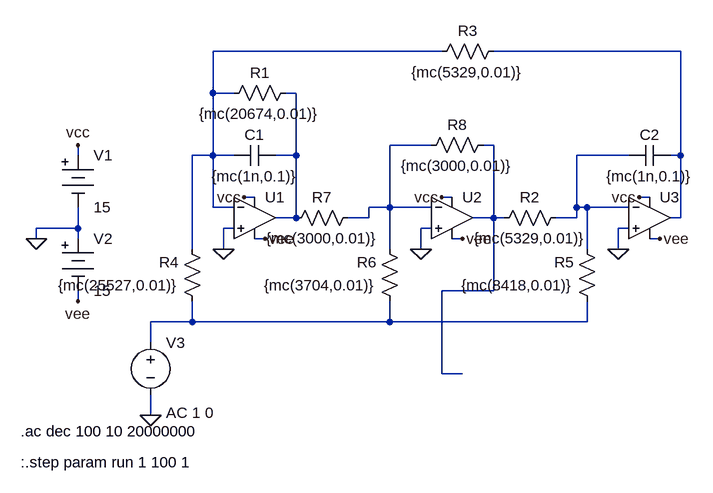
[diagram p0: schematic FlescherTow.asc]
FlescherTow.asc, the LTspice schematic file:
Version 4
SHEET 1 880 680
WIRE 352 -96 0 -96
WIRE 720 -96 432 -96
WIRE 0 -32 0 -96
WIRE 32 -32 0 -32
WIRE 128 -32 112 -32
WIRE 336 48 272 48
WIRE 432 48 416 48
WIRE -208 64 -208 48
WIRE 0 64 0 -32
WIRE 0 64 -32 64
WIRE 32 64 0 64
WIRE 128 64 128 -32
WIRE 128 64 96 64
WIRE 640 64 560 64
WIRE 720 64 720 -96
WIRE 720 64 704 64
WIRE 64 128 48 128
WIRE 368 128 352 128
WIRE 672 128 656 128
WIRE 0 144 0 64
WIRE 32 144 0 144
WIRE 272 144 272 48
WIRE 272 144 240 144
WIRE 336 144 272 144
WIRE 560 144 560 64
WIRE 576 144 560 144
WIRE 640 144 576 144
WIRE 128 160 128 64
WIRE 128 160 96 160
WIRE 240 160 240 144
WIRE 240 160 208 160
WIRE 432 160 432 48
WIRE 432 160 400 160
WIRE 448 160 432 160
WIRE 560 160 560 144
WIRE 560 160 528 160
WIRE 720 160 720 64
WIRE 720 160 704 160
WIRE -208 176 -208 144
WIRE -208 176 -272 176
WIRE 32 176 16 176
WIRE 336 176 320 176
WIRE 640 176 624 176
WIRE -272 192 -272 176
WIRE -208 192 -208 176
WIRE 80 192 64 192
WIRE 384 192 368 192
WIRE 688 192 672 192
WIRE -32 208 -32 64
WIRE 16 208 16 176
WIRE 272 208 272 144
WIRE 320 208 320 176
WIRE 576 208 576 144
WIRE 624 208 624 176
WIRE 432 272 432 160
WIRE 432 272 352 272
WIRE -208 288 -208 272
WIRE -32 320 -32 288
WIRE -32 320 -96 320
WIRE 272 320 272 288
WIRE 272 320 -32 320
WIRE 576 320 576 288
WIRE 576 320 272 320
WIRE -96 352 -96 320
WIRE 352 400 352 272
WIRE 384 400 352 400
WIRE -96 464 -96 432
FLAG -272 192 0
FLAG -208 48 vcc
FLAG 48 128 vcc
FLAG 352 128 vcc
FLAG 656 128 vcc
FLAG -208 288 vee
FLAG 80 192 vee
FLAG 384 192 vee
FLAG 688 192 vee
FLAG 624 208 0
FLAG 320 208 0
FLAG 16 208 0
FLAG -96 464 0
SYMBOL Opamps\\UniversalOpamp2 64 160 R0
SYMATTR InstName U1
SYMBOL Opamps\\UniversalOpamp2 368 160 R0
SYMATTR InstName U2
SYMBOL Opamps\\UniversalOpamp2 672 160 R0
SYMATTR InstName U3
SYMBOL res 128 -48 R90
WINDOW 0 0 56 VBottom 2
WINDOW 3 32 56 VTop 2
SYMATTR InstName R1
SYMATTR Value {mc(20674,0.01)}
SYMBOL res 544 144 R90
WINDOW 0 0 56 VBottom 2
WINDOW 3 32 56 VTop 2
SYMATTR InstName R2
SYMATTR Value {mc(5329,0.01)}
SYMBOL res 448 -112 R90
WINDOW 0 0 56 VBottom 2
WINDOW 3 32 56 VTop 2
SYMATTR InstName R3
SYMATTR Value {mc(5329,0.01)}
SYMBOL res -16 304 R180
WINDOW 0 36 76 Left 2
WINDOW 3 36 40 Left 2
SYMATTR InstName R4
SYMATTR Value {mc(25527,0.01)}
SYMBOL res 592 304 R180
WINDOW 0 36 76 Left 2
WINDOW 3 36 40 Left 2
SYMATTR InstName R5
SYMATTR Value {mc(8418,0.01)}
SYMBOL res 288 304 R180
WINDOW 0 36 76 Left 2
WINDOW 3 36 40 Left 2
SYMATTR InstName R6
SYMATTR Value {mc(3704,0.01)}
SYMBOL res 224 144 R90
WINDOW 0 0 56 VBottom 2
WINDOW 3 32 56 VTop 2
SYMATTR InstName R7
SYMATTR Value {mc(3000,0.01)}
SYMBOL res 432 32 R90
WINDOW 0 0 56 VBottom 2
WINDOW 3 32 56 VTop 2
SYMATTR InstName R8
SYMATTR Value {mc(3000,0.01)}
SYMBOL cap 96 48 R90
WINDOW 0 0 32 VBottom 2
WINDOW 3 32 32 VTop 2
SYMATTR InstName C1
SYMATTR Value {mc(1n,0.1)}
SYMBOL cap 704 48 R90
WINDOW 0 0 32 VBottom 2
WINDOW 3 32 32 VTop 2
SYMATTR InstName C2
SYMATTR Value {mc(1n,0.1)}
SYMBOL Misc\\battery -208 48 R0
WINDOW 123 0 0 Left 2
WINDOW 39 0 0 Left 2
SYMATTR InstName V1
SYMATTR Value 15
SYMBOL Misc\\battery -208 176 R0
WINDOW 123 0 0 Left 2
WINDOW 39 0 0 Left 2
SYMATTR InstName V2
SYMATTR Value 15
SYMBOL voltage -96 336 R0
WINDOW 123 24 124 Left 2
WINDOW 39 0 0 Left 2
SYMATTR Value2 AC 1 0
SYMATTR InstName V3
SYMATTR Value ""
TEXT -296 488 Left 2 !.ac dec 100 10 20000000
TEXT -296 536 Left 2 !:.step param run 1 100 1

The netlist it stands for:
* FlescherTow.asc
XU1 0 N001 vcc vee N003 level.2 Avol=1Meg GBW=10Meg Slew=10Meg ilimit=25m rail=0 Vos=0 phimargin=45 en=0 enk=0 in=0 ink=0 Rin=500Meg  ; pins IN+ IN- V+ V- OUT
XU2 0 N004 vcc vee N005 level.2 Avol=1Meg GBW=10Meg Slew=10Meg ilimit=25m rail=0 Vos=0 phimargin=45 en=0 enk=0 in=0 ink=0 Rin=500Meg  ; pins IN+ IN- V+ V- OUT
XU3 0 N006 vcc vee N002 level.2 Avol=1Meg GBW=10Meg Slew=10Meg ilimit=25m rail=0 Vos=0 phimargin=45 en=0 enk=0 in=0 ink=0 Rin=500Meg  ; pins IN+ IN- V+ V- OUT
R1 N003 N001 {mc(20674,0.01)}
R2 N006 N005 {mc(5329,0.01)}
R3 N002 N001 {mc(5329,0.01)}
R4 N007 N001 {mc(25527,0.01)}
R5 N007 N006 {mc(8418,0.01)}
R6 N007 N004 {mc(3704,0.01)}
R7 N004 N003 {mc(3000,0.01)}
R8 N005 N004 {mc(3000,0.01)}
C1 N003 N001 {mc(1n,0.1)}
C2 N002 N006 {mc(1n,0.1)}
V1 vcc 0 15
V2 0 vee 15
V3 N007 0 AC 1 0
.ac dec 100 10 20000000
:.step param run 1 100 1
.lib UniversalOpamps2.sub
.backanno
.end